# Altium schematic sheet StartButton.SchDoc
size A
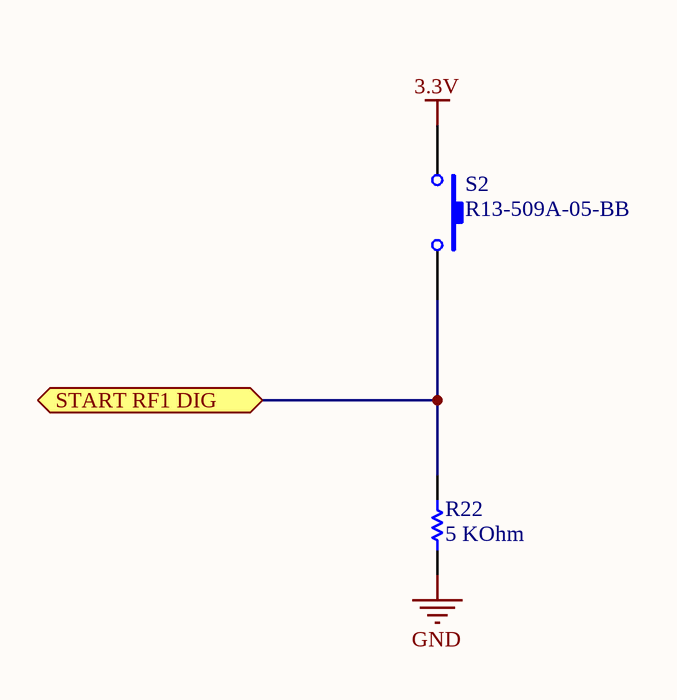
[diagram p0: StartButton.SchDoc]

## Parts
R22  5 KOhm  [Resistor0603]
S2  R13-509A-05-BB  [StartButton]

## Ports
START RF1 DIG

## Nets
3.3V: S2.1
GND: R22.1
START RF1 DIG: R22.2 S2.2 ; port START RF1 DIG

## Library data of the parts
R22 = Res1: Resistor; Published: 8-Jun-2000; LatestRevisionDate: 17-Jul-2002; LatestRevisionNote: Re-released for DXP Platform.; PackageReference: AXIAL-0.3; Publisher: Altium Limited; PackageDescription: Axial Device, Thru-Hole; 2 Leads; 0.3 in Pin Spacing; Value: 5 KOhm
S2 = SW-PB: Switch; Published: 24-Mar-1999; LatestRevisionDate: 17-Jul-2002; LatestRevisionNote: Re-released for DXP Platform.; PackageReference: SPST-2; Publisher: Altium Limited; PackageDescription: Switch; 2 Leads; Farnell Reference: 1634682